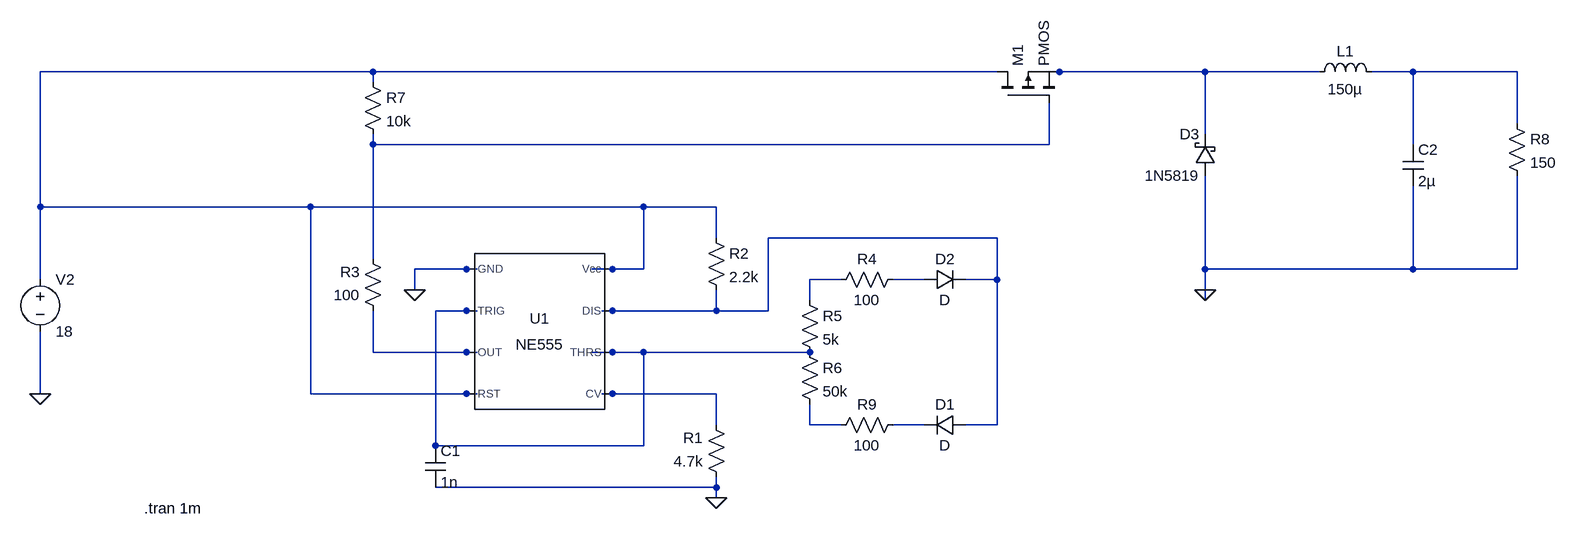
[diagram p0: schematic 555-Buck-Converter.asc]
555-Buck-Converter.asc, the LTspice schematic file:
Version 4
SHEET 1 1836 680
WIRE 0 -272 -512 -272
WIRE 960 -272 0 -272
WIRE 1056 -272 1040 -272
WIRE 1280 -272 1056 -272
WIRE 1456 -272 1280 -272
WIRE 1600 -272 1536 -272
WIRE 1760 -272 1600 -272
WIRE 0 -256 0 -272
WIRE 1760 -192 1760 -272
WIRE 1280 -176 1280 -272
WIRE 0 -160 0 -176
WIRE 1040 -160 1040 -224
WIRE 1040 -160 0 -160
WIRE 1600 -160 1600 -272
WIRE -512 -64 -512 -272
WIRE -96 -64 -512 -64
WIRE 416 -64 -96 -64
WIRE 528 -64 416 -64
WIRE 528 -16 528 -64
WIRE 960 -16 608 -16
WIRE 0 16 0 -160
WIRE 144 32 64 32
WIRE 160 32 144 32
WIRE 368 32 336 32
WIRE 416 32 416 -64
WIRE 416 32 368 32
WIRE 1280 32 1280 -112
WIRE 1600 32 1600 -96
WIRE 1600 32 1280 32
WIRE 1760 32 1760 -112
WIRE 1760 32 1600 32
WIRE -512 48 -512 -64
WIRE 720 48 672 48
WIRE 848 48 800 48
WIRE 960 48 960 -16
WIRE 960 48 912 48
WIRE 64 64 64 32
WIRE 1280 64 1280 32
WIRE 672 80 672 48
WIRE 1280 80 1280 64
WIRE 144 96 96 96
WIRE 160 96 144 96
WIRE 368 96 352 96
WIRE 528 96 528 64
WIRE 528 96 368 96
WIRE 608 96 608 -16
WIRE 608 96 528 96
WIRE 0 160 0 96
WIRE 144 160 0 160
WIRE 160 160 144 160
WIRE 368 160 336 160
WIRE 416 160 368 160
WIRE 672 160 416 160
WIRE -512 224 -512 128
WIRE -96 224 -96 -64
WIRE 144 224 -96 224
WIRE 160 224 144 224
WIRE 368 224 352 224
WIRE 528 224 368 224
WIRE 528 272 528 224
WIRE 672 272 672 240
WIRE 720 272 672 272
WIRE 848 272 800 272
WIRE 960 272 960 48
WIRE 960 272 912 272
WIRE 96 304 96 96
WIRE 416 304 416 160
WIRE 416 304 96 304
WIRE 528 368 528 352
WIRE 528 368 96 368
WIRE 528 384 528 368
FLAG 64 64 0
FLAG 528 384 0
FLAG -512 224 0
FLAG 1280 64 0
DATAFLAG -240 -64 ""
SYMBOL Misc\\NE555 256 128 R0
SYMATTR InstName U1
SYMBOL res 544 368 R180
WINDOW 0 36 76 Left 2
WINDOW 3 36 40 Left 2
SYMATTR InstName R1
SYMATTR Value 4.7k
SYMBOL cap 80 304 R0
SYMATTR InstName C1
SYMATTR Value 1n
SYMBOL res 512 -32 R0
SYMATTR InstName R2
SYMATTR Value 2.2k
SYMBOL res 816 32 R90
WINDOW 0 0 56 VBottom 2
WINDOW 3 32 56 VTop 2
SYMATTR InstName R4
SYMATTR Value 100
SYMBOL diode 912 256 R90
WINDOW 0 0 32 VBottom 2
WINDOW 3 32 32 VTop 2
SYMATTR InstName D1
SYMBOL diode 848 64 R270
WINDOW 0 32 32 VTop 2
WINDOW 3 0 32 VBottom 2
SYMATTR InstName D2
SYMBOL res 656 64 R0
SYMATTR InstName R5
SYMATTR Value 5k
SYMBOL res 656 144 R0
SYMATTR InstName R6
SYMATTR Value 50k
SYMBOL schottky 1296 -112 R180
WINDOW 0 24 64 Left 2
WINDOW 3 24 0 Left 2
SYMATTR InstName D3
SYMATTR Value 1N5819
SYMATTR Description Diode
SYMATTR Type diode
SYMBOL res 1744 -208 R0
SYMATTR InstName R8
SYMATTR Value 150
SYMBOL ind 1440 -256 R270
WINDOW 0 32 56 VTop 2
WINDOW 3 5 56 VBottom 2
SYMATTR InstName L1
SYMATTR Value 150µ
SYMBOL cap 1584 -160 R0
SYMATTR InstName C2
SYMATTR Value 2µ
SYMBOL res 16 112 R180
WINDOW 0 36 76 Left 2
WINDOW 3 36 40 Left 2
SYMATTR InstName R3
SYMATTR Value 100
SYMBOL voltage -512 32 R0
WINDOW 123 0 0 Left 0
WINDOW 39 0 0 Left 0
SYMATTR InstName V2
SYMATTR Value 18
SYMBOL pmos 960 -224 R270
SYMATTR InstName M1
SYMBOL res -16 -272 R0
SYMATTR InstName R7
SYMATTR Value 10k
SYMBOL res 816 256 R90
WINDOW 0 0 56 VBottom 2
WINDOW 3 32 56 VTop 2
SYMATTR InstName R9
SYMATTR Value 100
TEXT -352 400 Left 2 !.tran 1m

The netlist it stands for:
* 555-Buck-Converter.asc
XU1 0 N008 N009 N001 N010 N008 N005 N001 NE555  ; pins GND TRIG OUT RST CV THRS DIS Vcc
R1 0 N010 4.7k
C1 N008 0 1n
R2 N001 N005 2.2k
R4 N007 N006 100
D1 N005 N012 D
D2 N007 N005 D
R5 N006 N008 5k
R6 N008 N011 50k
D3 0 N002 1N5819
R8 N003 0 150
L1 N002 N003 150µ
C2 N003 0 2µ
R3 N009 N004 100
V2 N001 0 18
M1 N001 N004 N002 N002 PMOS
R7 N001 N004 10k
R9 N012 N011 100
.model D D
.lib standard.dio
.model NMOS NMOS
.model PMOS PMOS
.lib standard.mos
.tran 1m
.lib NE555.sub
.backanno
.end